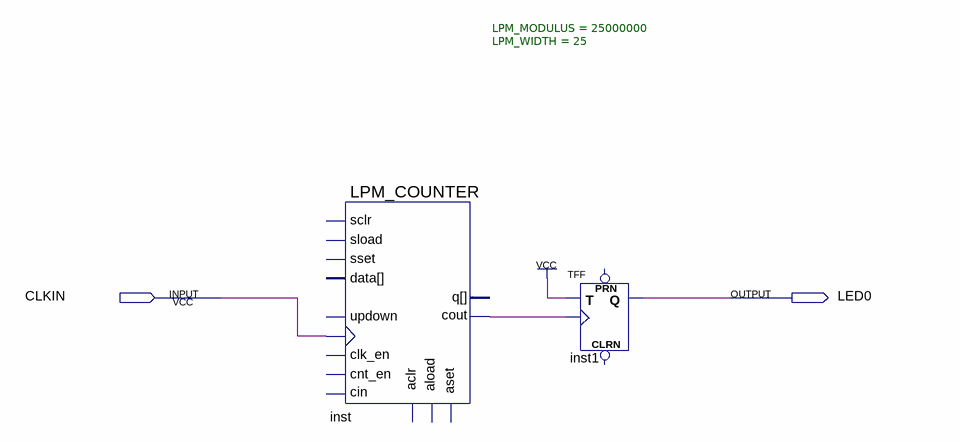
[diagram p0: schematic sheet]
// Quartus schematic contadorNovo.bdf as structural Verilog: 2 symbols, 2 pins
module contadorNovo (
  input  CLKIN,
  output LED0
);

  wire inst_cout;

  LPM_COUNTER #(.LPM_MODULUS(25000000), .LPM_WIDTH(25)) inst (
    .clock(CLKIN), .cout(inst_cout));  // open: sload, data, clk_en, aload, aclr, aset, cin, sset, updown, cnt_en, sclr, q
  TFF inst1 (.T(1'b1), .CLK(inst_cout), .Q(LED0));  // open: PRN, CLRN
endmodule
